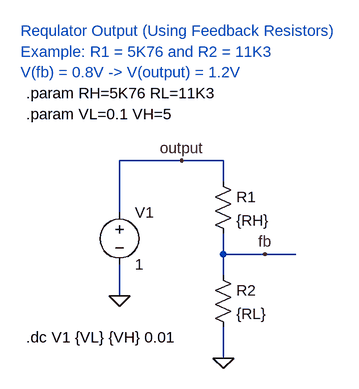
[diagram p0: schematic 12-voltage_divider_smps.asc]
12-voltage_divider_smps.asc, the LTspice schematic file:
Version 4
SHEET 1 880 680
WIRE 176 16 80 16
WIRE 240 16 176 16
WIRE 240 48 240 16
WIRE 80 96 80 16
WIRE 240 160 240 128
WIRE 304 160 240 160
WIRE 352 160 304 160
WIRE 240 192 240 160
WIRE 80 224 80 176
WIRE 240 320 240 272
FLAG 80 224 0
FLAG 240 320 0
FLAG 304 160 fb
FLAG 176 16 output
SYMBOL voltage 80 80 R0
WINDOW 123 0 0 Left 0
WINDOW 39 0 0 Left 0
SYMATTR InstName V1
SYMATTR Value 1
SYMBOL res 224 32 R0
SYMATTR InstName R1
SYMATTR Value {RH}
SYMBOL res 224 176 R0
SYMATTR InstName R2
SYMATTR Value {RL}
TEXT -64 288 Left 2 !.dc V1 {VL} {VH} 0.01
TEXT -72 -184 Left 2 ;Requlator Output (Using Feedback Resistors)
TEXT -72 -152 Left 2 ;Example: R1 = 5K76 and R2 = 11K3\nV(fb) = 0.8V -> V(output) = 1.2V
TEXT -64 -88 Left 2 !.param RH=5K76 RL=11K3
TEXT -64 -56 Left 2 !.param VL=0.1 VH=5

The netlist it stands for:
* 12-voltage_divider_smps.asc
V1 output 0 1
R1 output fb {RH}
R2 fb 0 {RL}
.dc V1 {VL} {VH} 0.01
* Requlator Output (Using Feedback Resistors)
* Example: R1 = 5K76 and R2 = 11K3
* V(fb) = 0.8V -> V(output) = 1.2V
.param RH=5K76 RL=11K3
.param VL=0.1 VH=5
.backanno
.end

* Results of the author's LTspice run, read from the files saved beside the schematic
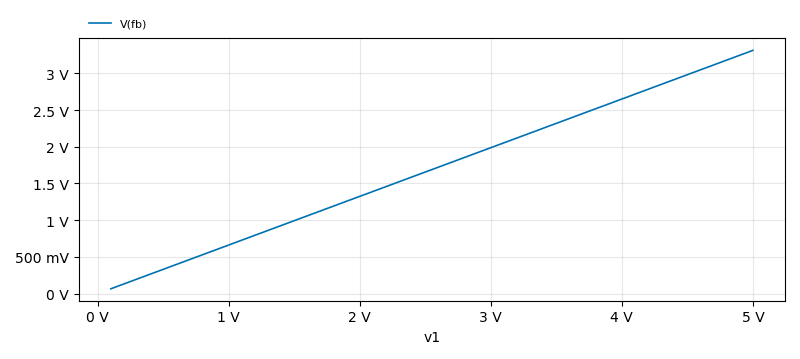
[diagram p1: DC transfer characteristic of 12-voltage_divider_smps.asc, plotted from the saved traces]
* DC transfer characteristic, 1 run:
*   V(fb): 66.24 mV at v1=100 mV, 3.312 V at v1=5 V, min 66.24 mV, max 3.312 V